# EAGLE design minnowboard-to-busblaster (EAGLE 7.6.0)
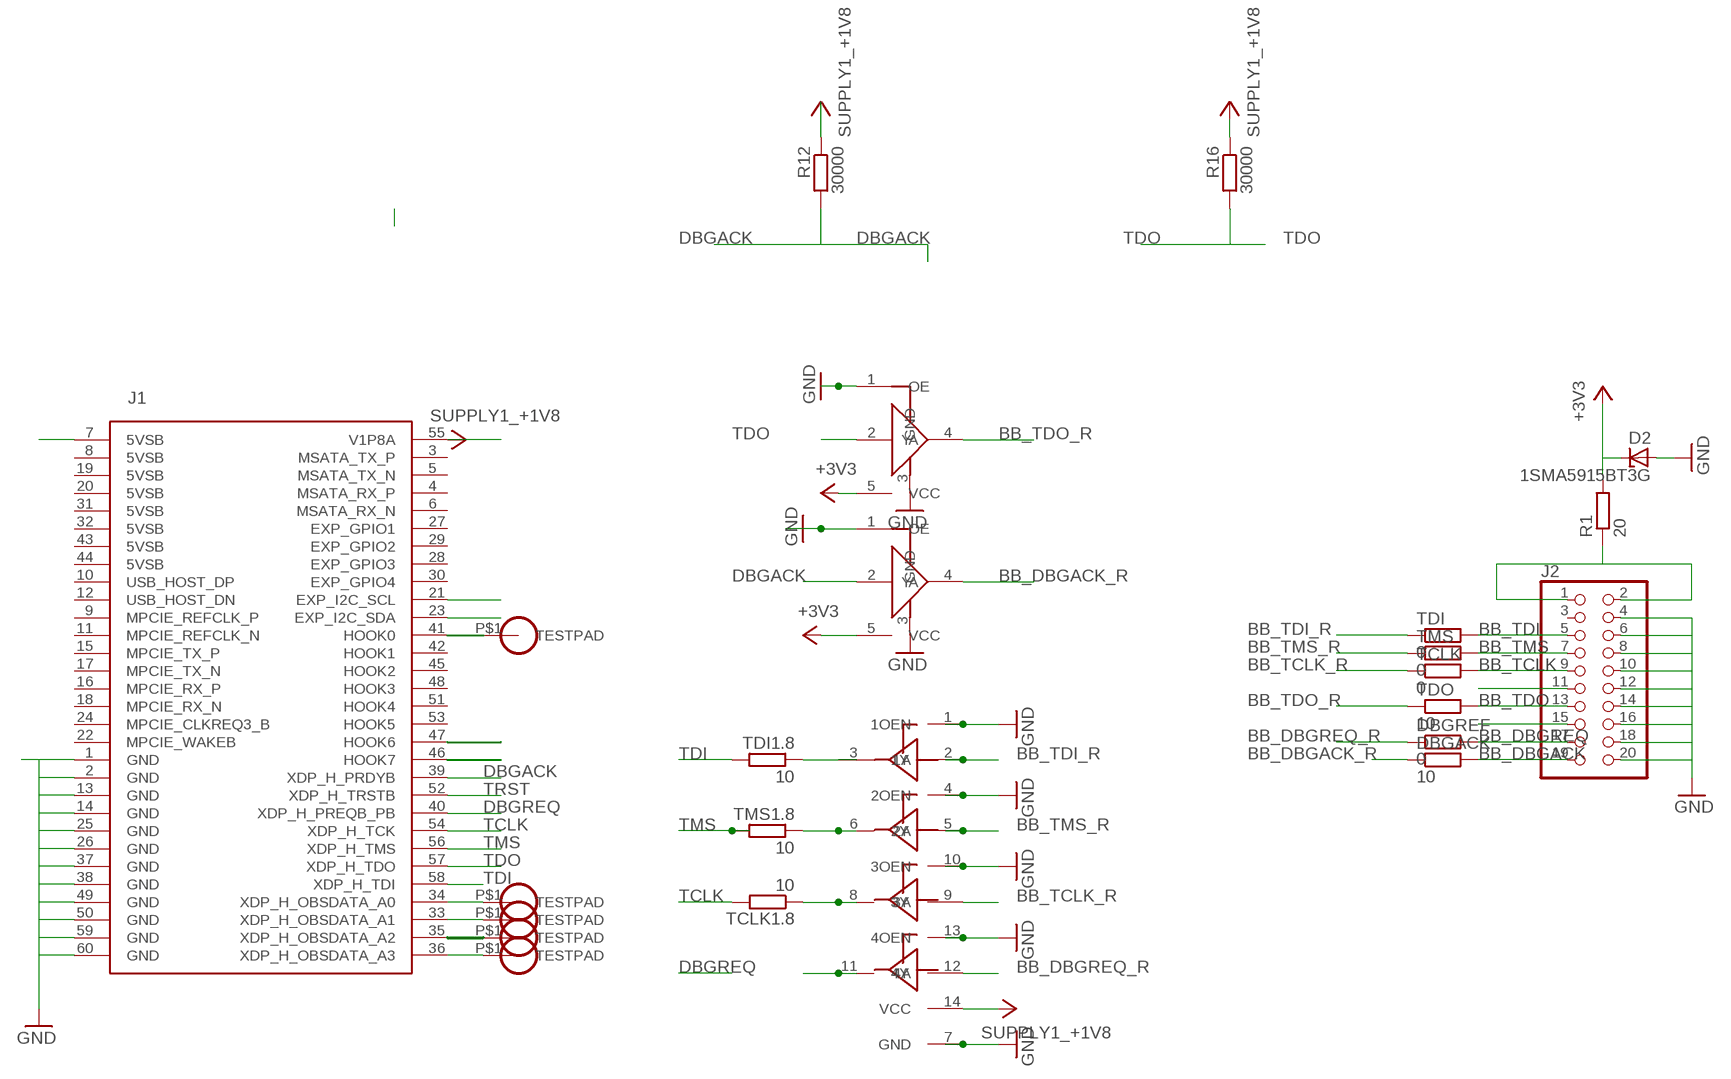
[diagram p0: schematic, sheet 1]

## Parts
A0  TESTPAD  [TESTPAD]
A1  TESTPAD  [TESTPAD]
A2  TESTPAD  [TESTPAD]
A3  TESTPAD  [TESTPAD]
D2  1SMA5915BT3G  DIODE_ZENER-DIODESMB  [DIODE_SMB]
DBGACK  10  R-EU_R0805  [R0805]
DBGREF  0  R-EU_R0805  [R0805]
J1  CIRCUITCO_MINNOW2_HIGH_SPEED  [CIRCUITCO_5177986-2]
J2  LPC1768BOARD_PINHEAD_-_COPY_PINHD-2X10SHROUDED  [LPC1768BOARD_PINHEAD_-_COPY_PINSHRD_PTH_2X10]
R1  20  R-EU_R0805  [R0805]
R12  30000  R-EU_R0805  [R0805]
R16  30000  R-EU_R0805  [R0805]
TCLK  0  R-EU_R0805  [R0805]
TCLK1.8  10  R-EU_R0805  [R0805]
TDI  0  R-EU_R0805  [R0805]
TDI1.8  10  R-EU_R0805  [R0805]
TDO  10  R-EU_R0805  [R0805]
TMS  0  R-EU_R0805  [R0805]
TMS1.8  10  R-EU_R0805  [R0805]
U1  SN74LV4T125  [PVQFN-N14]
U2  SN74LV1T125  [SC70-5]
U3  SN74LV1T125  [SC70-5]
U$1  TESTPAD  [TESTPAD]

## Nets
+1V8: J1.55(V1P8A) R12.1 R16.1 U1.14(VCC) ; supply symbol labelled SUPPLY1_+1V8
+3V3: D2.C R1.2 U2.5(VCC) U3.5(VCC)
BB_DBGACK: DBGACK.2 J2.19
BB_DBGACK_R: DBGACK.1 U2.4(Y)
BB_DBGREQ: DBGREF.2 J2.17
BB_DBGREQ_R: DBGREF.1 U1.12(4A)
BB_TCLK: J2.9 TCLK.2
BB_TCLK_R: TCLK.1 U1.9(3A)
BB_TDI: J2.5 TDI.2
BB_TDI_R: TDI.1 U1.2(1A)
BB_TDO: J2.13 TDO.2
BB_TDO_R: TDO.1 U3.4(Y)
BB_TMS: J2.7 TMS.2
BB_TMS_R: TMS.1 U1.5(2A)
DBGACK: J1.39(XDP_H_PRDYB) R12.2 U2.2(A)
DBGREQ: J1.40(XDP_H_PREQB_PB)
GND: D2.A J1.1(GND) J1.2(GND) J1.13(GND) J1.14(GND) J1.25(GND) J1.26(GND) J1.37(GND) J1.38(GND) J1.49(GND) J1.50(GND) J1.59(GND) J1.60(GND) J2.4 J2.18 J2.20 U1.1(1OEN) U1.4(2OEN) U1.7(GND) U1.10(3OEN) U1.13(4OEN) U2.1(OE) U2.3(GND) U3.1(OE) U3.3(GND)
N$1: J2.1 J2.2 R1.1
N$3: TMS1.8.1 U1.6(2Y)
N$4: TDI1.8.1 U1.3(1Y)
N$5: TCLK1.8.1 U1.8(3Y)
N$6: U1.11(4Y)
N$7: J1.7(5VSB)
N$8: A2.P$1(TESTPAD) J1.35(XDP_H_OBSDATA_A2)
N$9: A0.P$1(TESTPAD) J1.34(XDP_H_OBSDATA_A0)
N$10: J2.11
N$11: A1.P$1(TESTPAD) J1.33(XDP_H_OBSDATA_A1)
N$12: J2.15
N$14: A3.P$1(TESTPAD) J1.36(XDP_H_OBSDATA_A3)
N$15: J1.21(EXP_I2C_SCL)
N$16: J1.23(EXP_I2C_SDA)
N$17: J2.6
N$18: J2.8
N$19: J2.10
N$20: J2.12
N$21: J2.14
N$22: J2.16
N$23: J1.46(HOOK7)
N$24: J1.47(HOOK6)
RMRST: J1.41(HOOK0) U$1.P$1(TESTPAD)
TCLK: J1.54(XDP_H_TCK) TCLK1.8.2
TDI: J1.58(XDP_H_TDI) TDI1.8.2
TDO: J1.57(XDP_H_TDO) R16.2 U3.2(A)
TMS: J1.56(XDP_H_TMS) TMS1.8.2
TRST: J1.52(XDP_H_TRSTB)
Unconnected: J1.3(MSATA_TX_P) J1.4(MSATA_RX_P) J1.5(MSATA_TX_N) J1.6(MSATA_RX_N) J1.8(5VSB) J1.9(MPCIE_REFCLK_P) J1.10(USB_HOST_DP) J1.11(MPCIE_REFCLK_N) J1.12(USB_HOST_DN) J1.15(MPCIE_TX_P) J1.16(MPCIE_RX_P) J1.17(MPCIE_TX_N) J1.18(MPCIE_RX_N) J1.19(5VSB) J1.20(5VSB) J1.22(MPCIE_WAKEB) J1.24(MPCIE_CLKREQ3_B) J1.27(EXP_GPIO1) J1.28(EXP_GPIO3) J1.29(EXP_GPIO2) J1.30(EXP_GPIO4) J1.31(5VSB) J1.32(5VSB) J1.42(HOOK1) J1.43(5VSB) J1.44(5VSB) J1.45(HOOK2) J1.48(HOOK3) J1.51(HOOK4) J1.53(HOOK5) J2.3

## Library data of the parts
A0 A1-A3 U$1 = minnowboard:TESTPAD
D2 = minnowboard:DIODE_ZENER-DIODE: Z-Diode
DBGACK DBGREF R1 R12 R16 TCLK TCLK1.8 TDI TDI1.8 TDO TMS TMS1.8 = resistor:R-EU_: RESISTOR, European symbol
J1 = JTAG_Adapter_A2_ccBYNC:CIRCUITCO_MINNOW2_HIGH_SPEED
J2 = BusBlaster-v3a:LPC1768BOARD_PINHEAD_-_COPY_PINHD-2X10: PIN HEADER
U1 = minnowboard:SN74LV4T125
U2 U3 = minnowboard:SN74LV1T125

## Board
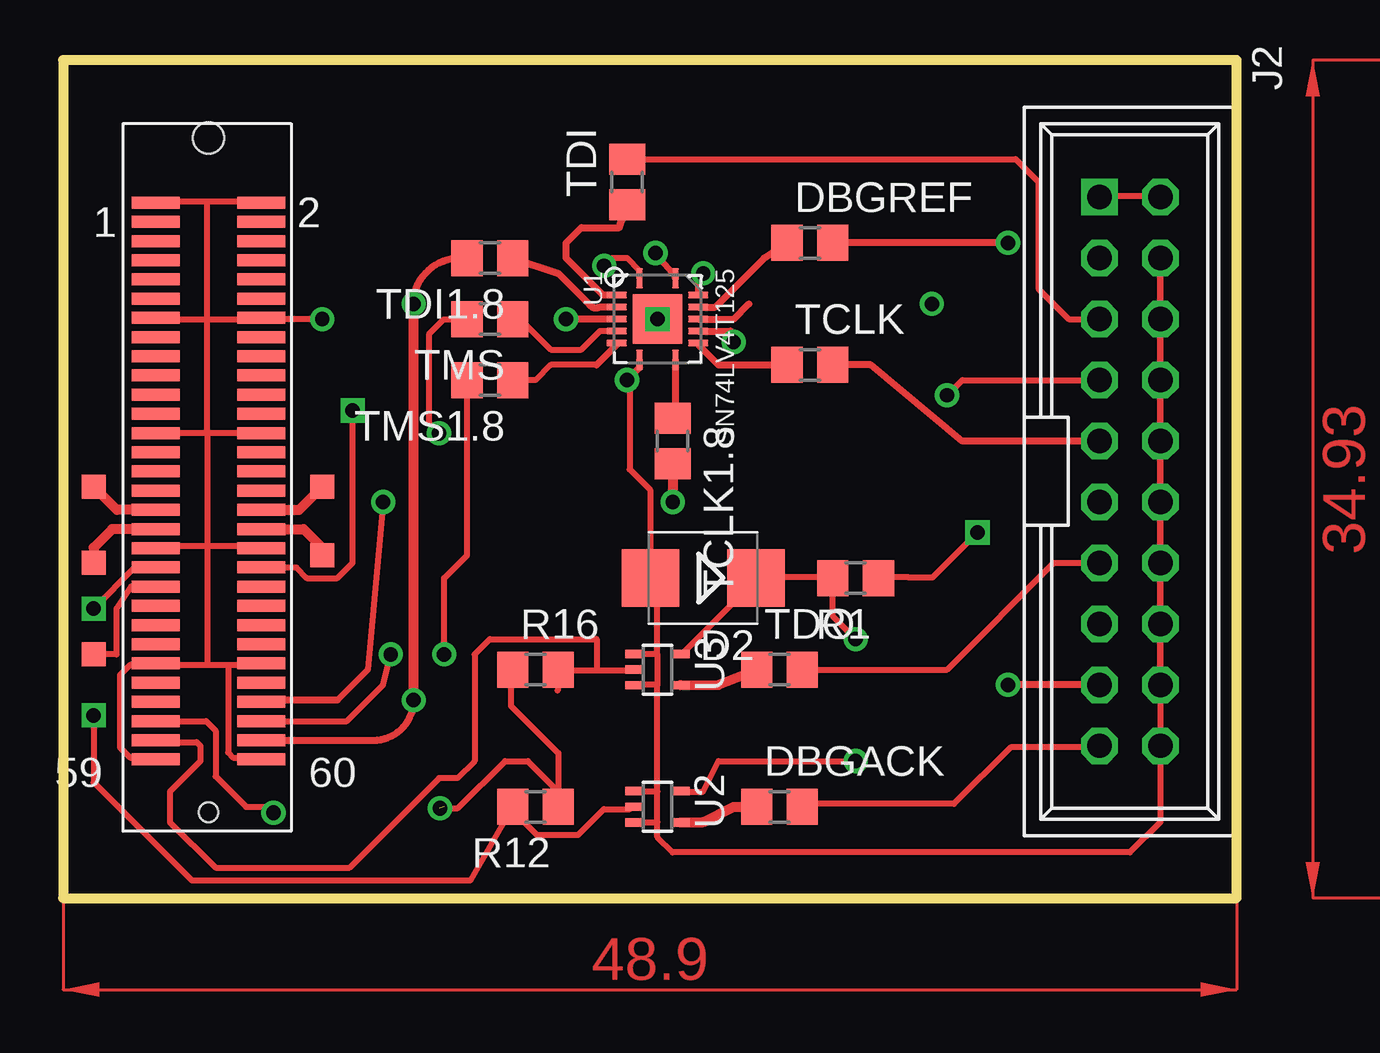
[diagram p1: board, top side]
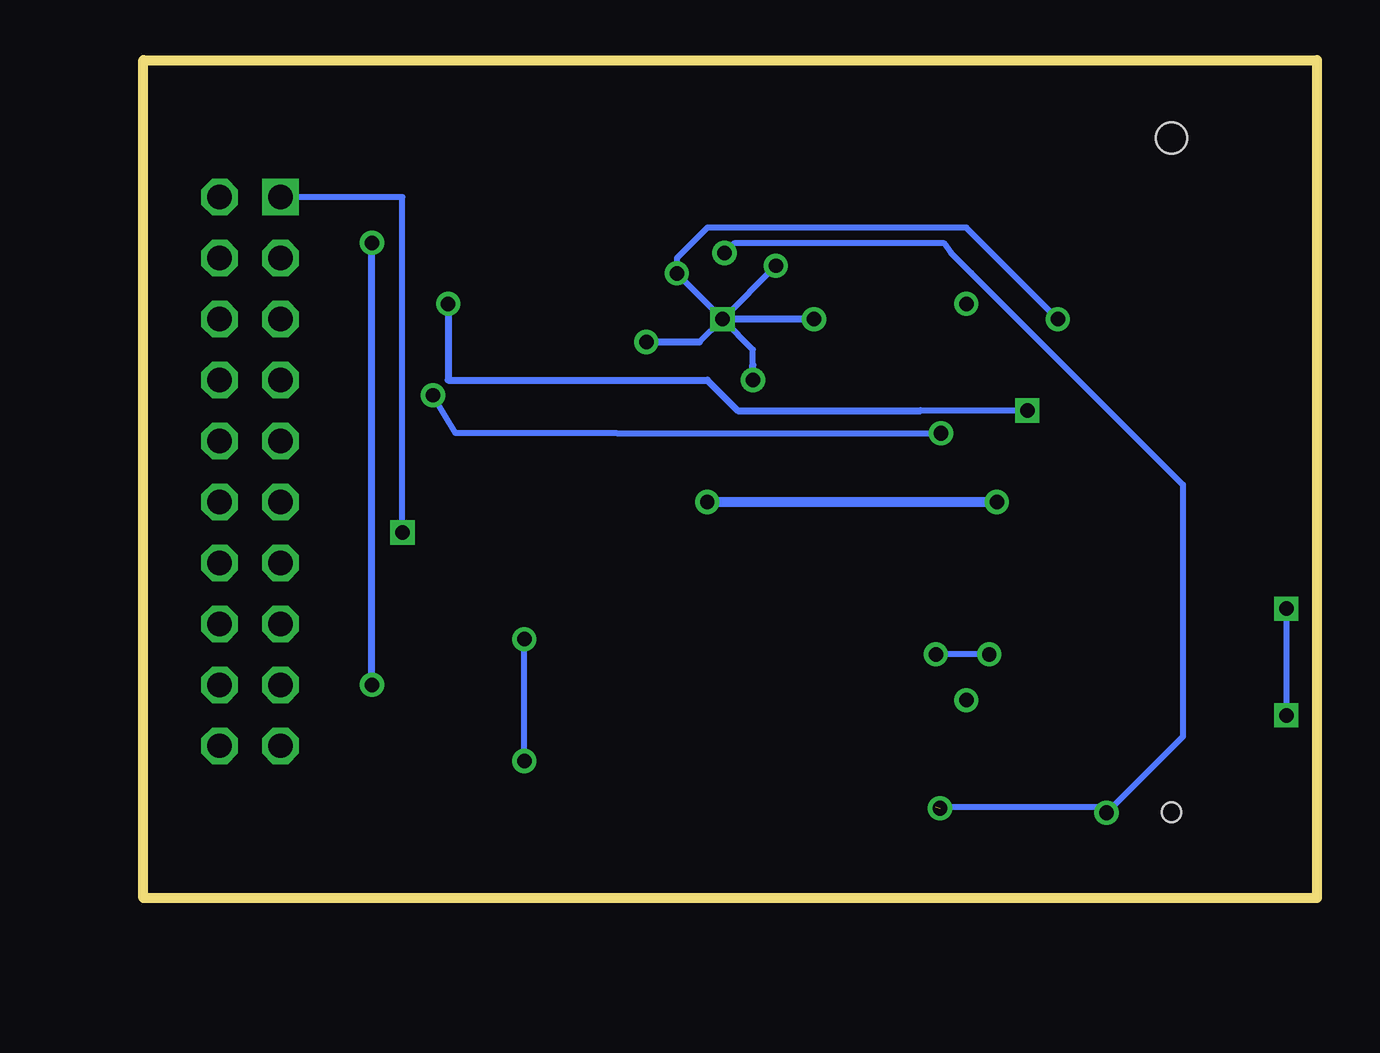
[diagram p2: board, bottom side, seen from below]

Size 48.9 x 34.93 mm. Coordinates in mm from the lower left corner, seen from the top.
Outline: 0,34.93 0,0 48.9,0 48.9,34.93 0,34.93
Copper layers (1*16): Top 0.035mm / dielectric 1.5mm / Bottom 0.035mm
Design rules "default *": minimum track width 10mil, minimum drill 24mil, track to track 0.17500625mm, track to pad 8mil, pad to pad 8mil, via to via 8mil, smd to smd 8mil, copper to edge 40mil, drill to drill 8mil, minimum pad ring 10mil, minimum via ring 8mil, stop-mask expansion 4mil, vias tented up to drill 0mil, thermal gap 10mil

### Footprints (pad centres in the part's own frame; a part is rotated, then mirrored left to right if it is on the bottom)
TESTPAD = smd 1 x 1: P$1 0,0
DIODE_SMB = smd 2.4 x 2.4: A 2.2,0; C -2.2,0
R0805 = smd 1.3 x 1.5: 1 -0.95,0; 2 0.95,0
CIRCUITCO_5177986-2 = smd 0.5 x 2: 1 11.2,4.4; 2 11.2,0; 3 10.4,4.4; 4 10.4,0; 5 9.6,4.4; 6 9.6,0; 7 8.8,4.4; 8 8.8,0; 9 8,4.4; 10 8,0; 11 7.2,4.4; 12 7.2,0; 13 6.4,4.4; 14 6.4,0; 15 5.6,4.4; 16 5.6,0; 17 4.8,4.4; 18 4.8,0; 19 4,4.4; 20 4,0; 21 3.2,4.4; 22 3.2,0; 23 2.4,4.4; 24 2.4,0; 25 1.6,4.4; 26 1.6,0; 27 0.8,4.4; 28 0.8,0; 29 0,4.4; 30 0,0; 31 -0.8,4.4; 32 -0.8,0; 33 -1.6,4.4; 34 -1.6,0; 35 -2.4,4.4; 36 -2.4,0; 37 -3.2,4.4; 38 -3.2,0; 39 -4,4.4; 40 -4,0; 41 -4.8,4.4; 42 -4.8,0; 43 -5.6,4.4; 44 -5.6,0; 45 -6.4,4.4; 46 -6.4,0; 47 -7.2,4.4; 48 -7.2,0; 49 -8,4.4; 50 -8,0; 51 -8.8,4.4; 52 -8.8,0; 53 -9.6,4.4; 54 -9.6,0; 55 -10.4,4.4; 56 -10.4,0; 57 -11.2,4.4; 58 -11.2,0; 59 -12,4.4; 60 -12,0 | hole 0.8: -14.2,2.2 | hole 1.3: 13.9,2.2
LPC1768BOARD_PINHEAD_-_COPY_PINSHRD_PTH_2X10 = drill 1.016 square: 1 -11.43,-1.27 | drill 1.016 octagon: 2 -11.43,1.27; 3 -8.89,-1.27; 4 -8.89,1.27; 5 -6.35,-1.27; 6 -6.35,1.27; 7 -3.81,-1.27; 8 -3.81,1.27; 9 -1.27,-1.27; 10 -1.27,1.27; 11 1.27,-1.27; 12 1.27,1.27; 13 3.81,-1.27; 14 3.81,1.27; 15 6.35,-1.27; 16 6.35,1.27; 17 8.89,-1.27; 18 8.89,1.27; 19 11.43,-1.27; 20 11.43,1.27
PVQFN-N14 = smd 0.28 x 0.85: 1 -0.75,1.7; 7 -0.75,-1.7; 8 0.75,-1.7; 14 0.75,1.7 | smd 0.85 x 0.28: 2 -1.7,1; 3 -1.7,0.5; 4 -1.7,0; 5 -1.7,-0.5; 6 -1.7,-1; 9 1.7,-1; 10 1.7,-0.5; 11 1.7,0; 12 1.7,0.5; 13 1.7,1 | smd 2.05 x 2.05: P$1 0,0
SC70-5 = smd 0.35 x 0.8: 1 -0.65,-0.95; 2 0,-0.95; 3 0.65,-0.95; 4 0.65,0.95; 5 -0.65,0.95

### Placement (x,y rotation side)
A0  10.79,17.15 0 top
A1  1.27,17.15 0 top
A2  1.27,13.97 0 top
A3  10.79,14.29 0 top
D2  26.67,13.33 180 top
DBGACK  29.84,3.81 0 top
DBGREF  31.11,27.3 0 top
J1  8.26,17.78 90 top
J2  44.45,17.78 270 top
R1  33.02,13.33 180 top
R12  19.68,3.81 180 top
R16  19.68,9.53 0 top
TCLK  31.11,22.23 0 top
TCLK1.8  25.4,19.05 270 top
TDI  23.49,29.84 90 top
TDI1.8  17.78,26.67 180 top
TDO  29.84,9.53 0 top
TMS  17.78,24.13 180 top
TMS1.8  17.78,21.59 180 top
U1  24.76,24.13 0 top
U2  24.76,3.81 270 top
U3  24.76,9.53 270 top
U$1  1.27,10.16 0 top

### Tracks (layer width: path | path; a pad name or v marks a point on that pad's centre or on a via)
+1V8  (via drill 0.61)  (1 unrouted)
  Top 0.25: 25.51,25.92 v24.68,26.88 | 18.67,8.01 20.63,6.04 20.63,4.45 | 20.63,4.45 R12.1 | J1.55 5.96,7.38 6.35,6.98 6.35,5.08 7.62,3.81 8.51,3.81 v8.76,3.56 | v15.7,3.75 16.45,3.75 18.41,5.71 19.36,5.71 20.63,4.45
  Top 0.254: 20.6,3.93 R12.1 | 18.67,8.01 18.67,9.51 R16.1
  Top 0.3: U1.14 25.51,25.92
  Bottom 0.25: 14.4,26.04 15.24,26.88 15.56,27.3 24.25,27.3 v24.68,26.88 | 5.59,17.23 5.59,6.73 v8.76,3.56 9.01,3.81 15.88,3.81
  Bottom 0.254: 5.59,17.23 14.4,26.04
+3V3  (via drill 0.6)
  Top 0.25: U2.5 25.73,4.45 26.67,4.45 27.3,5.71 v33.02,5.71 | v33.02,10.79 32.07,11.74 R1.2
  Top 0.254: U3.5 25.75,10.15 28.75,13.15 D2.C 28.97,13.37 31.97,13.37 R1.2
  Bottom 0.25: v33.02,5.71 v33.02,10.79
BB_DBGACK
  Top 0.254: DBGACK.2 30.9,3.93 37.12,3.93 39.48,6.29 43.12,6.29 J2.19
BB_DBGACK_R
  Top 0.406: U2.4 26.67,3.18 27.94,3.81 DBGACK.1
BB_DBGREQ  (via drill 0.6)
  Top 0.3: J2.17 v39.37,8.89 | v39.37,27.3 DBGREF.2
  Bottom 0.3: v39.37,8.89 v39.37,27.3
BB_DBGREQ_R
  Top 0.3: U1.12 27.17,24.63 29.21,26.67 DBGREF.1
BB_TCLK
  Top 0.3: J2.9 37.47,19.05 33.66,22.23 TCLK.2
BB_TCLK_R
  Top 0.3: U1.9 26.46,23.06 27.3,22.23 TCLK.1
BB_TDI
  Top 0.25: TDI.2 39.69,30.8 40.64,29.84 40.64,25.4 41.91,24.13 J2.5
BB_TDI_R
  Top 0.3: U1.2 22.49,25.13 20.95,26.67 20.95,27.3 21.59,27.94 23.17,27.94 TDI.1
BB_TDO
  Top 0.25: TDO.2 36.83,9.53 41.27,13.97 J2.13
BB_TDO_R
  Top 0.406: U3.4 27.3,8.89 TDO.1
BB_TMS  (via drill 0.6, 0.61)
  Top 0.25: 16.74,24.09 15.84,24.09 15.24,23.49 15.24,19.8 v15.67,19.37 | v36.83,20.95 37.47,21.59 J2.7
  Top 0.254: 16.74,24.09 TMS.2
  Bottom 0.25: 29.18,19.37 35.88,19.37 v36.83,20.95 | 43.12,21.52 43.05,21.59
  Bottom 0.254: 29.18,19.37 v15.67,19.37 | 43.12,21.52 J2.7
BB_TMS_R
  Top 0.25: TMS.1 19.05,24.13 20.32,22.86 21.59,22.86 22.36,23.63 U1.5
DBGACK  (via drill 0.6)
  Top 0.25: J1.39 2.99,13.78 v1.27,12.06 | v1.27,7.62 1.27,4.83 5.37,0.73
  Top 0.254: 18.67,3.71 19.74,2.64 21.46,2.64 22.53,3.71 23.6,3.71 U2.2 | 5.37,0.73 16.95,0.73 18.67,3.71 | 18.67,3.71 R12.2
  Bottom 0.25: v1.27,12.06 v1.27,7.62
DBGREQ  (via drill 0.6)
  Top 0.25: J1.40 9.71,13.78 10.16,13.33 11.43,13.33 12.06,13.97 v12.06,20.32
  Bottom 0.25: v12.06,20.32 16.51,20.32
  Bottom 0.3: v36.2,24.77 36.2,21.59 25.4,21.59 24.13,20.32 16.51,20.32
GND  (via drill 0.6)
  Top 0.25: U2.3 24.75,3.16 24.76,3.18 | 24.76,3.18 24.76,4.45 | 24.76,4.45 23.83,4.45 U2.1 24.75,4.46 24.76,4.45 | 24.76,10.16 23.83,10.16 U3.1 | 24.76,10.16 24.76,8.89 | 24.76,8.89 23.83,8.89 U3.3 | 24.76,10.16 24.76,13.04 D2.A | v10.79,24.13 8.3,24.13 J1.14 | U1.1 24.01,26.15 23.49,26.67 22.86,26.67 v22.54,26.35 | J2.18 J2.4 J2.20 45.72,3.18 44.45,1.91 25.4,1.91 24.76,2.54 24.76,3.18 | 24.76,4.45 24.76,8.89 | U1.13 26.46,25.83 v26.67,26.03 26.46,26.03 U1.13
  Top 0.254: J1.59 3.66,5.86 2.8,5.86 2.37,6.29 2.37,9.29 2.8,9.72 3.66,9.72 J1.49 3.87,9.72 6.02,9.72 | 6.02,9.72 6.87,9.72 | 6.87,9.72 8.16,9.72 J1.50 | 6.02,29.03 8.16,29.03 J1.2 | 6.02,29.03 3.87,29.03 J1.1 | 6.02,24.09 8.16,24.09 J1.14 | 6.02,24.09 3.87,24.09 J1.13 | 6.02,14.65 8.16,14.65 J1.38 | 6.02,14.65 3.87,14.65 J1.37 | 6.02,19.37 8.16,19.37 J1.26 | 6.02,19.37 3.87,19.37 J1.25 | 6.02,19.37 6.02,14.65 | 6.02,19.37 6.02,24.09 | 6.02,24.09 6.02,29.03 | 6.02,14.65 6.02,9.72 | 6.87,9.72 6.87,6.07 7.09,5.86 8.16,5.86 J1.60 | J2.18 45.74,8.79 45.74,6.42 J2.20 | D2.A 24.46,13.37 24.46,17.01 23.6,17.87 23.6,21.52 v23.49,21.59
  Top 0.3: U1.10 27.8,23.63 arc-90 v27.94,23.18 | U1.4 v20.95,24.13 | U1.7 24.01,22.11 v23.49,21.59
  Bottom 0.25: v10.79,24.13 14.61,27.94 25.4,27.94 26.67,26.67 v26.67,26.03 v24.76,24.13 | 25.72,23.18 v24.76,24.13 | 24.13,23.49 v24.76,24.13 | 23.49,22.23 23.49,22.86 v24.76,24.13 | v22.54,26.35 v24.76,24.13
  Bottom 0.3: v20.95,24.13 v24.76,24.13 | v23.49,21.59 23.49,22.23 | v27.94,23.18 25.72,23.18
N$1  (via drill 0.6)
  Top 0.25: 35.23,13.37 36.23,13.37 v38.1,15.24
  Top 0.254: J2.1 43.34,29.24 45.7,29.24 J2.2 | 35.23,13.37 34.12,13.37 R1.1
  Bottom 0.25: v38.1,15.24 38.1,29.21 J2.1
N$3
  Top 0.25: 22.22,22.23 20.32,22.23 19.68,21.59 TMS1.8.1
  Top 0.3: U1.6 23.06,23.06 22.22,22.23
N$4
  Top 0.3: TDI1.8.1 20.64,26.03 21.91,24.77 arc90 22.36,24.63 U1.3
N$5
  Top 0.3: U1.8 25.51,20.12 arc-90 TCLK1.8.1
N$6
  Top 0.3: U1.11 27.94,24.13 28.57,24.77
N$8
  Top 0.406: J1.35 2.04,15.38 1.27,14.6 A2.P$1
N$9
  Top 0.406: J1.34 9.83,16.18 A0.P$1
N$11
  Top 0.406: J1.33 2.24,16.18 A1.P$1
N$14
  Top 0.406: J1.36 10.02,15.38 10.79,14.6 A3.P$1
RMRST
  Top 0.25: J1.41 2.82,12.98 2.22,12.06 2.22,10.16 U$1.P$1
TCLK  (via drill 0.6)
  Top 0.25: v13.34,16.51 12.7,9.53 11.43,8.26
  Top 0.3: 11.43,8.26 8.33,8.26 J1.54
  Top 0.406: TCLK1.8.2 v25.4,16.51
  Bottom 0.406: v25.4,16.51 v13.34,16.51
TDI  (via drill 0.6)
  Top 0.3: J1.58 12.93,6.58 arc90 v14.61,8.26 | v14.61,24.77 arc-90 16.51,26.67 TDI1.8.2
  Top 0.406: v14.61,8.26 v14.61,24.77
TDO
  Top 0.25: 22.22,9.51 22.22,10.79 17.78,10.79 17.14,10.16 17.14,5.71 16.43,5 15.67,5 11.94,1.27 6.35,1.27 4.45,3.18 4.45,4.45 5.71,5.71 5.71,6.35 5.56,6.5 3.87,6.5
  Top 0.254: U3.2 23.6,9.51 22.22,9.51 20.81,9.51 R16.2 20.6,9.51 20.6,8.65 | 3.87,6.5 J1.57
TMS  (via drill 0.6)
  Top 0.25: J1.56 11.83,7.38 13.34,8.89 v13.65,10.16 | 16.51,21.59 TMS1.8.2 16.83,14.29 15.88,13.33 v15.88,10.16
  Bottom 0.25: v13.65,10.16 v15.88,10.16
(copper drawn outside any net)
  shapes: Top area x2